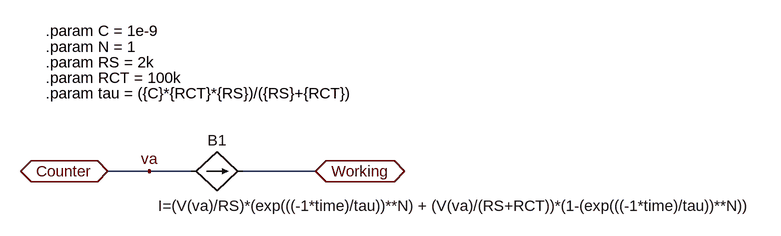
[diagram p0: schematic KWW_ArbitraryCurrentSource.asc]
KWW_ArbitraryCurrentSource.asc, the LTspice schematic file:
Version 4
SHEET 1 1320 680
WIRE 288 96 224 96
WIRE 352 96 288 96
WIRE 544 96 432 96
FLAG 224 96 Counter
IOPIN 224 96 BiDir
FLAG 544 96 Working
IOPIN 544 96 BiDir
FLAG 288 96 va
SYMBOL bi 352 96 R270
WINDOW 0 32 40 VTop 2
WINDOW 3 -37 413 VBottom 2
SYMATTR InstName B1
SYMATTR Value I=(V(va)/RS)*(exp(((-1*time)/tau))**N) + (V(va)/(RS+RCT))*(1-(exp(((-1*time)/tau))**N))
TEXT 128 -120 Left 2 !.param C = 1e-9
TEXT 128 -96 Left 2 !.param N = 1
TEXT 128 -72 Left 2 !.param RS = 2k
TEXT 128 -48 Left 2 !.param RCT = 100k
TEXT 128 -24 Left 2 !.param tau = ({C}*{RCT}*{RS})/({RS}+{RCT})

The netlist it stands for:
* KWW_ArbitraryCurrentSource.asc
B1 va Working I=(V(va)/RS)*(exp(((-1*time)/tau))**N) + (V(va)/(RS+RCT))*(1-(exp(((-1*time)/tau))**N))
.param C = 1e-9
.param N = 1
.param RS = 2k
.param RCT = 100k
.param tau = ({C}*{RCT}*{RS})/({RS}+{RCT})
.backanno
.end